# EAGLE design CM_V2-1 (EAGLE 9.4.2)
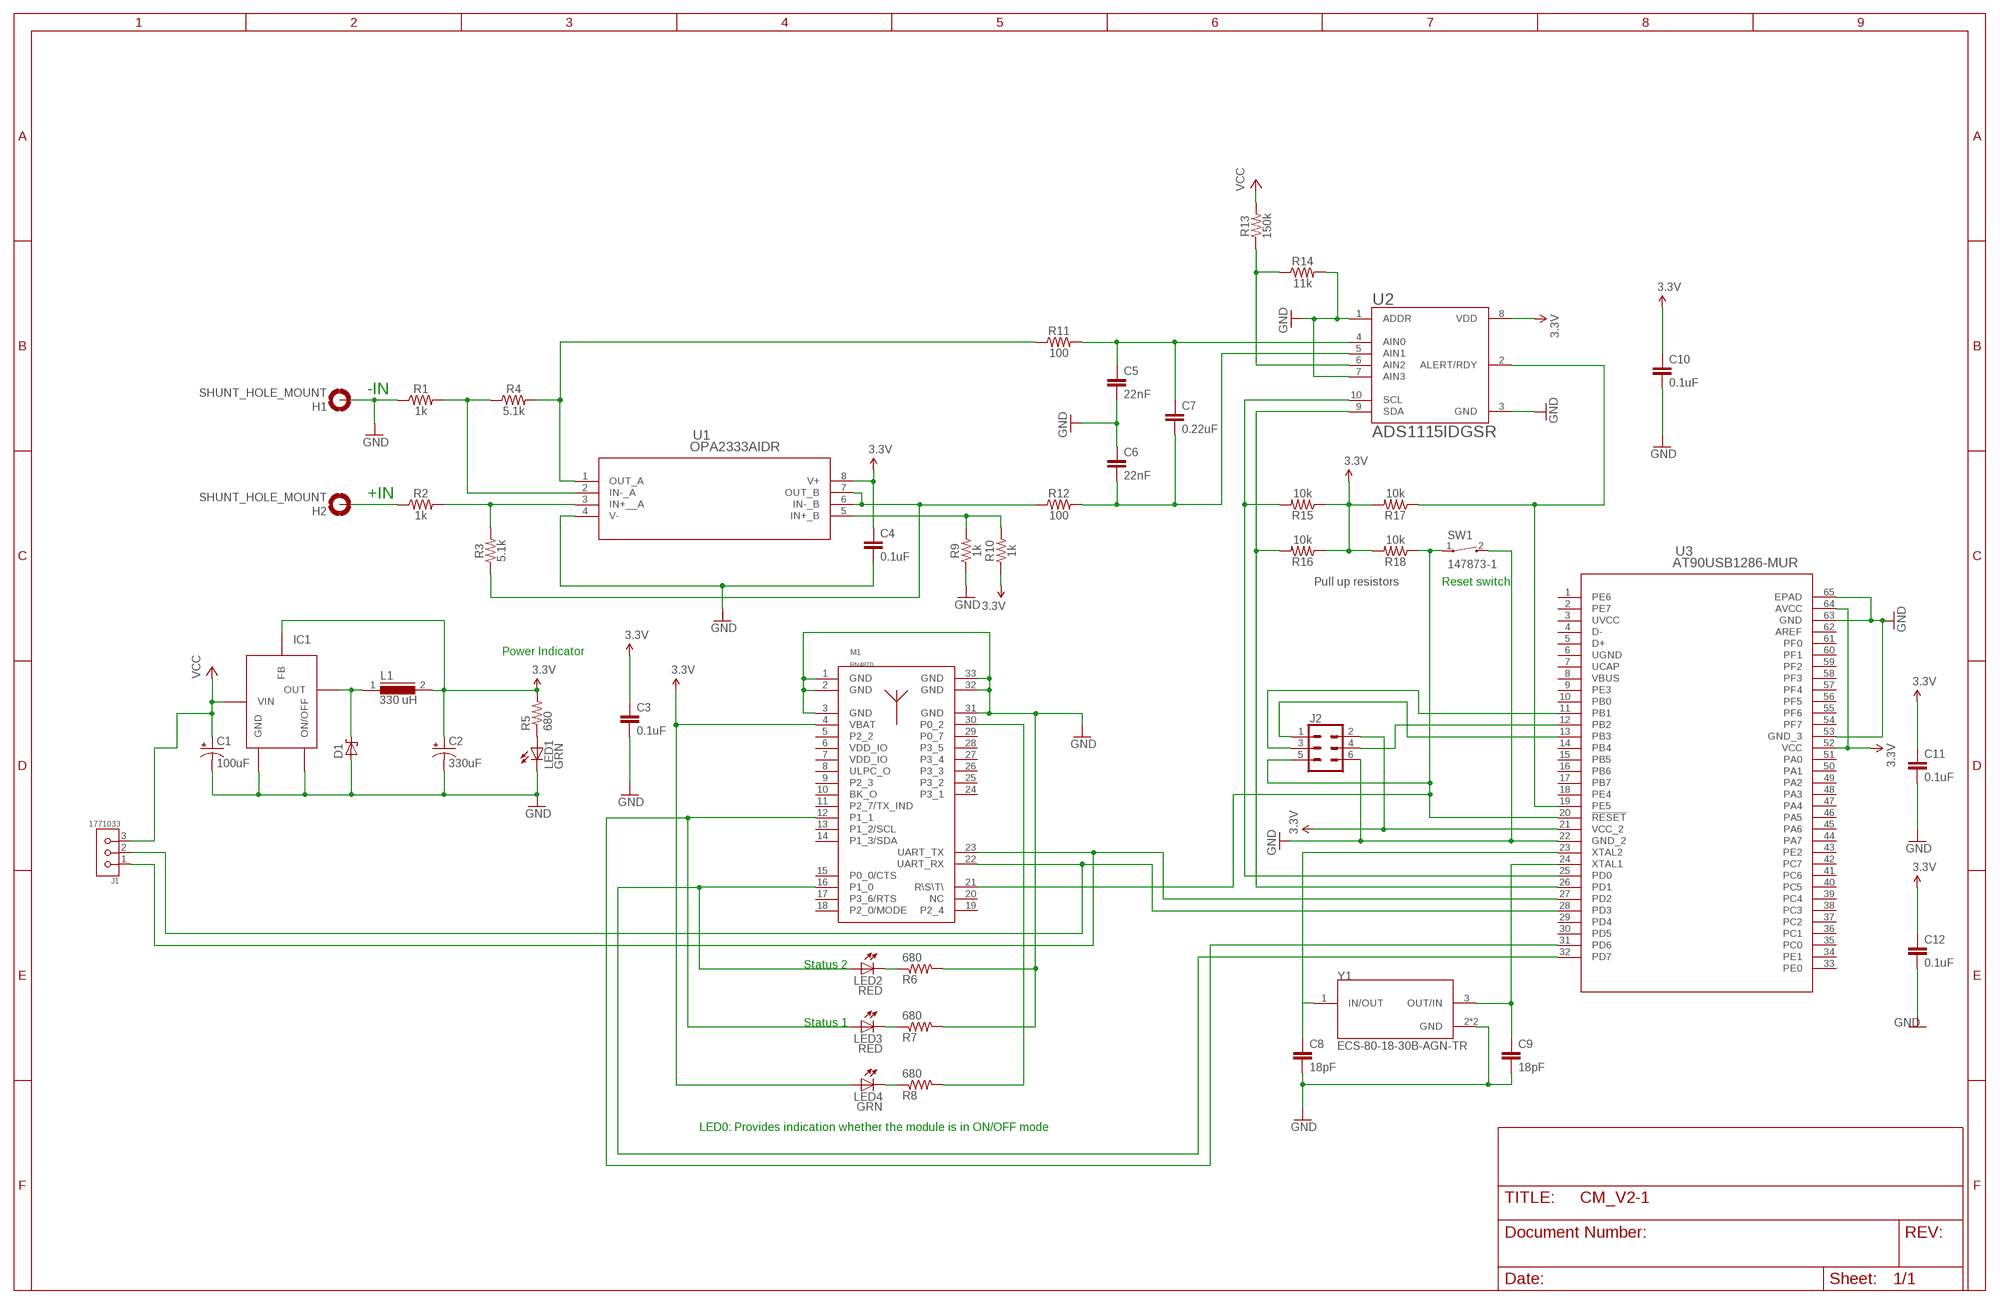
[diagram p0: schematic, sheet 1]

## Parts
C1  100uF  CAP_POLF  [F_CAP]
C2  330uF  CAP_POLF  [F_CAP]
C3  0.1uF  0.1UF-0603-25V-5%  [0603]
C4  0.1uF  0.1UF-0603-25V-(+80/-20%)  [0603]
C5  22nF  22NF/22,000PF-0603-50V-10%  [0603]
C6  22nF  22NF/22,000PF-0603-50V-10%  [0603]
C7  0.22uF  0.22UF-0603-25V-10%  [0603]
C8  18pF  18PF-0603-50V-5%  [0603]
C9  18pF  18PF-0603-50V-5%  [0603]
C10  0.1uF  0.1UF-0603-25V-5%  [0603]
C11  0.1uF  0.1UF-0603-25V-5%  [0603]
C12  0.1uF  0.1UF-0603-25V-5%  [0603]
D1  SCHOTTKY_DIODE  [SMD_DIODE]
H1  SHUNT_HOLE_MOUNT  [4,1-PAD]
H2  SHUNT_HOLE_MOUNT  [4,1-PAD]
IC1  TL2575  [TO-263-6]
J1  1771033  [PHOENIX_1771033]
J2  CONN_03X2FEMALE_SMD  [2X3_SMD]
L1  330 uH  DR125  [DR125]
LED1  GRN  LED0603  [0603_LED]
LED2  RED  LED0603  [0603_LED]
LED3  RED  LED0603  [0603_LED]
LED4  GRN  LED0603  [0603_LED]
M1  RN4870  [RN4870]
R1  1k  1KOHM-0603-1/10W-1%  [0603]
R2  1k  1KOHM-0603-1/10W-1%  [0603]
R3  5.1k  RESISTOR0603  [0603]
R4  5.1k  RESISTOR0603  [0603]
R5  680  RESISTOR0603  [0603_RESISTOR]
R6  680  RESISTOR0603  [0603_RESISTOR]
R7  680  RESISTOR0603  [0603_RESISTOR]
R8  680  RESISTOR0603  [0603_RESISTOR]
R9  1k  1KOHM-0603-1/10W-1%  [0603]
R10  1k  1KOHM-0603-1/10W-1%  [0603]
R11  100  100OHM-0603-1/4W-5%  [0603]
R12  100  100OHM-0603-1/4W-5%  [0603]
R13  150k  150KOHM-0603-1/10W-1%  [0603]
R14  11k  RESISTOR0603  [0603]
R15  10k  10KOHM-0603-1/10W-1%  [0603]
R16  10k  10KOHM-0603-1/10W-1%  [0603]
R17  10k  10KOHM-0603-1/10W-1%  [0603]
R18  10k  10KOHM-0603-1/10W-1%  [0603]
SW1  147873-1  [SW_147873-1]
U1  OPA2333AIDR  [D8]
U2  ADS1115IDGSR  [SOP50P490X110-10N]
U3  AT90USB1286-MUR  [PS]
Y1  ECS-80-18-30B-AGN-TR  [XTAL_ECS-80-18-30B-AGN-TR]

## Nets
3.3V: C2.+ C3.1 C4.1 C10.1 C11.1 C12.1 IC1.4(FB) J2.2 L1.2 LED4.A M1.4(VBAT) R5.2 R10.1 R15.1 R16.1 R17.2 R18.2 U1.8(V+) U2.8(VDD) U3.21(VCC_2) U3.52(VCC) U3.64(AVCC)
GND: C1.- C2.- C3.2 C4.2 C5.2 C6.1 C8.2 C9.2 C10.2 C11.2 C12.2 D1.A H1.B4,1(MOUNT) IC1.3(GND) IC1.5(ON/OFF) J2.6 LED1.C M1.1(GND) M1.2(GND) M1.3(GND) M1.31(GND) M1.32(GND) M1.33(GND) R1.1 R6.2 R7.2 R9.1 R14.2 SW1.2 U1.4(V-) U2.1(ADDR) U2.3(GND) U2.7(AIN3) U3.22(GND_2) U3.53(GND_3) U3.63(GND) U3.65(EPAD) Y1.2(GND) Y1.4(GND)
N$1: C5.1 C7.1 R11.2 U2.4(AIN0)
N$2: R9.2 R10.2 U1.5(IN+_B)
N$3: R15.2 U2.10(SCL) U3.25(PD0)
N$4: R16.2 U2.9(SDA) U3.26(PD1)
N$5: H2.B4,1(MOUNT) R2.1
N$6: R4.2 R11.1 U1.1(OUT_A)
N$7: C6.2 C7.2 R12.2 U2.5(AIN1)
N$8: R1.2 R4.1 U1.2(IN-_A)
N$9: J1.2 M1.22(UART_RX) U3.28(PD3)
N$10: J1.1 M1.23(UART_TX) U3.27(PD2)
N$11: D1.C IC1.2(OUT) L1.1
N$12: LED1.A R5.1
N$13: R2.2 R3.2 U1.3(IN+__A)
N$14: R3.1 R12.1 U1.6(IN-_B) U1.7(OUT_B)
N$15: LED2.C R6.1
N$16: LED3.C R7.1
N$17: LED4.C R8.1
N$18: M1.30(P0_2) R8.2
N$19: LED3.A M1.12(P1_1) U3.31(PD6)
N$20: LED2.A M1.16(P1_0) U3.32(PD7)
N$21: J2.4 U3.12(PB2)
N$22: J2.1 U3.13(PB3)
N$23: J2.3 U3.11(PB1)
N$24: J2.5 M1.21(R\S\T\) R18.1 SW1.1 U3.20(!RESET)
N$25: C8.1 U3.23(XTAL2) Y1.1(IN/OUT)
N$26: C9.1 U3.24(XTAL1) Y1.3(OUT/IN)
N$27: R17.1 U2.2(ALERT/RDY) U3.19(PE5)
N$30: R13.1 R14.1 U2.6(AIN2)
VCC: C1.+ IC1.1(VIN) J1.3 R13.2
Unconnected: M1.5(P2_2) M1.8(ULPC_O) M1.9(P2_3) M1.10(BK_O) M1.11(P2_7/TX_IND) M1.13(P1_2/SCL) M1.14(P1_3/SDA) M1.15(P0_0/CTS) M1.17(P3_6/RTS) M1.18(P2_0/MODE) M1.19(P2_4) M1.20(NC) M1.24(P3_1) M1.25(P3_2) M1.26(P3_3) M1.27(P3_4) M1.28(P3_5) M1.29(P0_7) U3.1(PE6) U3.2(PE7) U3.4(D-) U3.5(D+) U3.7(UCAP) U3.9(PE3) U3.10(PB0) U3.14(PB4) U3.15(PB5) U3.16(PB6) U3.17(PB7) U3.18(PE4) U3.29(PD4) U3.30(PD5) U3.33(PE0) U3.34(PE1) U3.35(PC0) U3.36(PC1) U3.37(PC2) U3.38(PC3) U3.39(PC4) U3.40(PC5) U3.41(PC6) U3.42(PC7) U3.43(PE2) U3.44(PA7) U3.45(PA6) U3.46(PA5) U3.47(PA4) U3.48(PA3) U3.49(PA2) U3.50(PA1) U3.51(PA0) U3.54(PF7) U3.55(PF6) U3.56(PF5) U3.57(PF4) U3.58(PF3) U3.59(PF2) U3.60(PF1) U3.61(PF0)

## Notes on the sheet
- -IN
- +IN
- Pull up resistors | Reset switch
- Power Indicator
- Status 2
- Status 1
- LED0: Provides indication whether the module is in ON/OFF mode

## Power pins joined to a net without a drawn wire
AREF: U3.62(AREF)
UGND: U3.6(UGND)
UVCC: U3.3(UVCC)
VBUS: U3.8(VBUS)
VDD_IO: M1.6(VDD_IO) M1.7(VDD_IO)

## Library data of the parts
C1 = jkf:CAP_POL; DIGIKEY#: PCE3917CT-ND
C2 = jkf:CAP_POL; DIGIKEY#: PCE3401CT-ND
C3 C10-C12 = SparkFun-Capacitors:0.1UF: 0.1µF ceramic capacitors A capacitor is a passive two-terminal electrical component used to store electrical energy temporarily in an electric field.; PROD_ID: CAP-08604
C4 = SparkFun-Capacitors:0.1UF: 0.1µF ceramic capacitors A capacitor is a passive two-terminal electrical component used to store electrical energy temporarily in an electric field.; PROD_ID: CAP-00810
C5 C6 = SparkFun-Capacitors:22NF/22,000PF: 0.022uF/22nF/22,000pF ceramic capacitors A capacitor is a passive two-terminal electrical component used to store electrical energy temporarily in an electric field.; PROD_ID: CAP-07885
C7 = SparkFun-Capacitors:0.22UF: 0.22µF ceramic capacitors A capacitor is a passive two-terminal electrical component used to store electrical energy temporarily in an electric field.; PROD_ID: CAP-07822
C8 C9 = SparkFun-Capacitors:18PF: 18pF ceramic capacitors A capacitor is a passive two-terminal electrical component used to store electrical energy temporarily in an electric field.; PROD_ID: CAP-08267
D1 = jkf:SCHOTTKY_DIODE; DIGIKEY#: 1N5819HW-FDICT-ND; MANF: Diodes Inc; MANF#: 1N5819HW-7-F
H1 H2 = custom_hole_shunt:SHUNT_HOLE_MOUNT
IC1 = jkf:TL2575; DIGIKEY#: 296-21828-1-ND; MANF: Texas Instruments; MANF#: TL2575-33IKTTR
J1 = 1771033:1771033: Fixed Miniature Connectors, Spring Cage, Horizontal, SMD, 3 Pos; DESCRIPTION: Fixed Miniature Connectors, Spring Cage, Horizontal, SMD, 3 Pos; DIGI-KEY_PART_NUMBER: 277-2066-1-ND; DIGI-KEY_PURCHASE_URL: https://www.digikey.com/product-detail/en/phoenix-contact/1771033/277-2066-1-ND/2192476?utm_source=snapeda&utm_medium=aggregator&utm_campaign=symbol; MF: Phoenix Contact; MP: 1771033; PACKAGE: None
J2 = SparkFun-Connectors:CONN_03X2: Multi connection point. Often used as Generic Header-pin footprint for 0.1 inch spaced/style header connections You can populate with any combo of single row headers, but if you'd like an exact match, check these: Header - 2x3 (Male, 0.1") <https://www.sparkfun.com/products/12807> (PRT-12807) Header - 2x3 (Female, 0.1") <https://www.sparkfun.com/products/13010> (PRT-13010) 2x3 Pin Shrouded Header <https://www.sparkfun.com/products/10877> (PRT-10877) On any of the 0.1 inch spaced packages, you can populate with these: Break Away Headers - Straight <https://www.sparkfun.com/products/116> (PRT-00116) Break Away Male Headers - Right Angle <https://www.sparkfun.com/products/553> (PRT-00553) Female Headers <https://www.sparkfun.com/products/115> (PRT-00115) Break Away Headers - Machine Pin <https://www.sparkfun.com/products/117> (PRT-00117) Break Away Female Headers - Swiss Machine Pin <https://www.sparkfun.com/products/743> (PRT-00743) Special note: the shrouded connector mates well with our 3x2 ribbon cables: Ribbon Crimp Connector - 6-pin (2x3, Female) <https://www.sparkfun.com/products/10651> (PRT-10651) Ribbon Cable - 6 wire (15ft) <https://www.sparkfun.com/products/10646> (PRT-10646); PROD_ID: CONN-11290
L1 = jkf:DR125; DIGIKEY#: SRR1208-102KLCT-ND
LED1-LED4 = jkf:LED; DIGIKEY#: 516-2493-1-ND; MANF: Avago Technologies; MANF#: HSMG-C191
M1 = RN4870:RN4870
R1 R2 R9 R10 = SparkFun-Resistors:1KOHM: 1kΩ resistor A resistor is a passive two-terminal electrical component that implements electrical resistance as a circuit element. Resistors act to reduce current flow, and, at the same time, act to lower voltage levels within circuits. - Wikipedia; PROD_ID: RES-07856
R3 R4 R14 = SparkFun-Resistors:RESISTOR: Generic Resistor Package
R5-R8 = jkf:RESISTOR; DIGIKEY#: P680GCT-ND
R11 R12 = SparkFun-Resistors:100OHM: 100Ω resistor A resistor is a passive two-terminal electrical component that implements electrical resistance as a circuit element. Resistors act to reduce current flow, and, at the same time, act to lower voltage levels within circuits. - Wikipedia; PROD_ID: RES-12438
R13 = SparkFun-Resistors:150KOHM: 150kΩ resistor A resistor is a passive two-terminal electrical component that implements electrical resistance as a circuit element. Resistors act to reduce current flow, and, at the same time, act to lower voltage levels within circuits. - Wikipedia; PROD_ID: RES-09117
R15-R18 = SparkFun-Resistors:10KOHM: 10kΩ resistor A resistor is a passive two-terminal electrical component that implements electrical resistance as a circuit element. Resistors act to reduce current flow, and, at the same time, act to lower voltage levels within circuits. - Wikipedia; PROD_ID: RES-00824
SW1 = 147873-1:147873-1: Switch Tactile OFF (ON) SPST Rectangular Button J-Bend 0.05A 24VDC 1.77N SMD T/R; AVAILABILITY: Unavailable; COMMENT: 147873-1; DESCRIPTION: Switch Tactile OFF _ON_ SPST Rectangular Button J-Bend 0.05A 24VDC 1.77N SMD T/R; MF: TE Connectivity; MP: 147873-1; PACKAGE: None; PRICE: None; TE_PURCHASE_URL: https://www.te.com/usa-en/product-147873-1.html?te_bu=Cor&te_type=disp&te_campaign=seda_glo_cor-seda-global-disp-prtnr-fy19-seda-model-bom-cta_sma-317_1&elqCampaignId=32493
U1 = OPA2333AIDR:OPA2333AIDR; MANUFACTURER_PART_NUMBER: OPA2333AIDR; VENDOR: Texas Instruments
U2 = ADS1115IDGSR:ADS1115IDGSR: 16-Bit ADC with Integrated MUX, PGA, Comparator, Oscillator, and Reference 10-VSSOP -40 to 125; DESCRIPTION: 16-Bit ADC with Integrated MUX, PGA, Comparator, Oscillator, and Reference 10-VSSOP -40 to 125; DIGI-KEY_PART_NUMBER: 296-38849-1-ND; DIGI-KEY_PURCHASE_URL: https://www.digikey.com/product-detail/en/texas-instruments/ADS1115IDGSR/296-38849-1-ND/5142969?utm_source=snapeda&utm_medium=aggregator&utm_campaign=symbol; MF: Texas Instruments; MP: ADS1115IDGSR; PACKAGE: MSOP-10 Texas Instruments
U3 = AT90USB1286:AT90USB1286-MUR; MANUFACTURER_PART_NUMBER: AT90USB1286MUR; VENDOR: Atmel
Y1 = ECS-80-18-30B-AGN-TR:ECS-80-18-30B-AGN-TR: The ECX-53B is a miniature SMD Crystal with a 3.2 x 5 mm footprint. This package is ideal for todays compact wireless applications where board space is critical.; DESCRIPTION: Crystal 8MHz ±25ppm _Tol_ ±30ppm _Stability_ 18pF FUND 100Ohm 4-Pin Mini-SMD T/R; DIGI-KEY_PART_NUMBER: XC2709CT-ND; DIGI-KEY_PURCHASE_URL: https://www.digikey.com/product-detail/en/ecs-inc/ECS-80-18-30B-AGN-TR/XC2709CT-ND/8023644?utm_source=snapeda&utm_medium=aggregator&utm_campaign=symbol; MF: ECS Inc.; MP: ECS-80-18-30B-AGN-TR; PACKAGE: SMD-4 ECS International

## Board
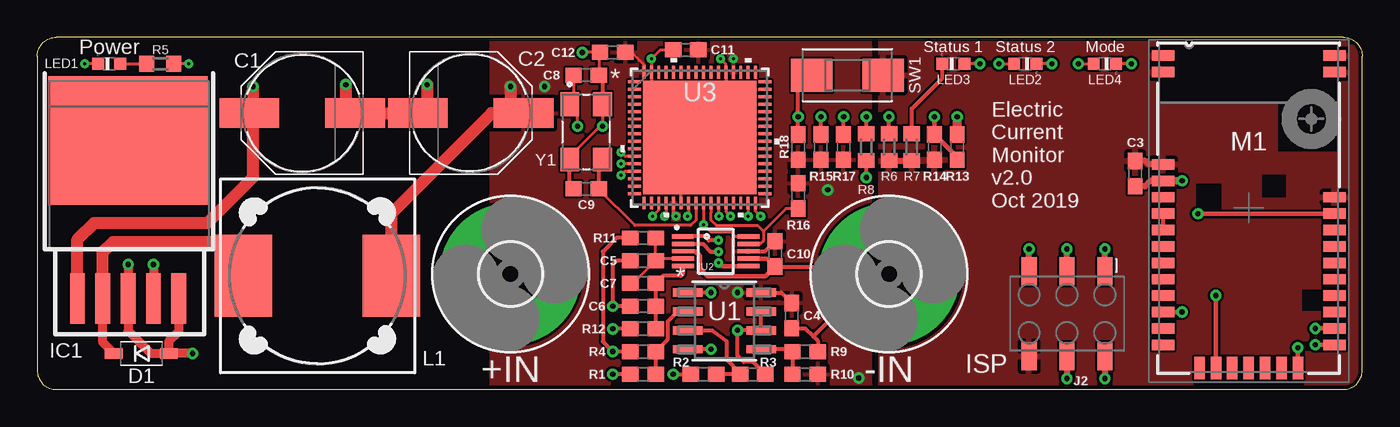
[diagram p1: board, top side]
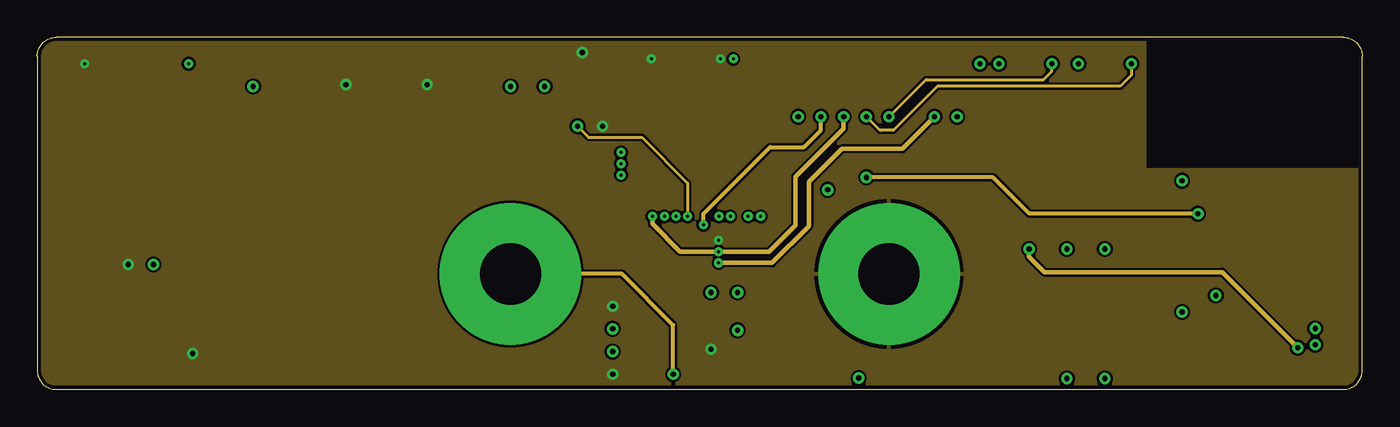
[diagram p2: board, inner layer Route2]
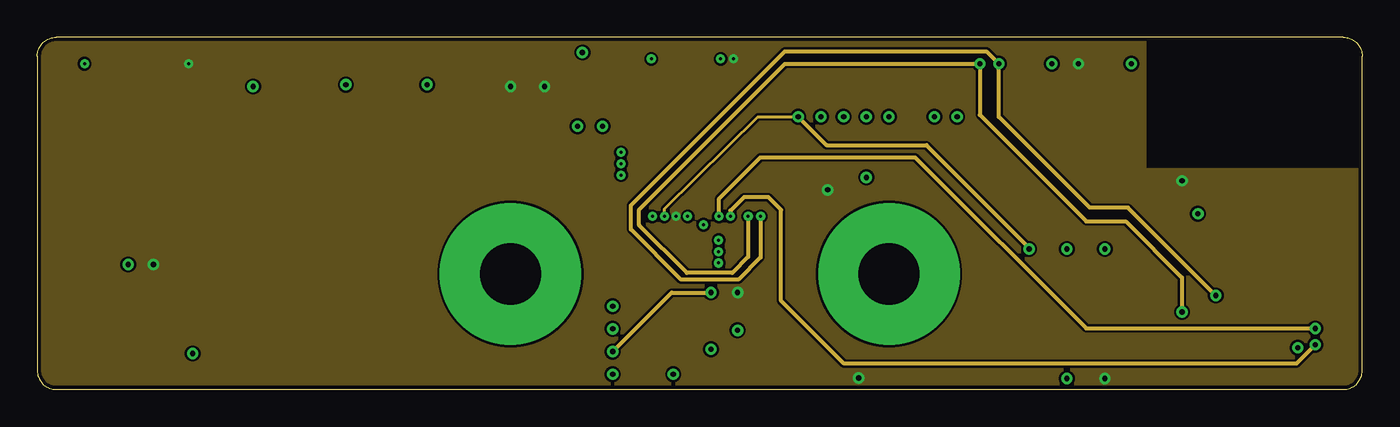
[diagram p3: board, inner layer Route15]
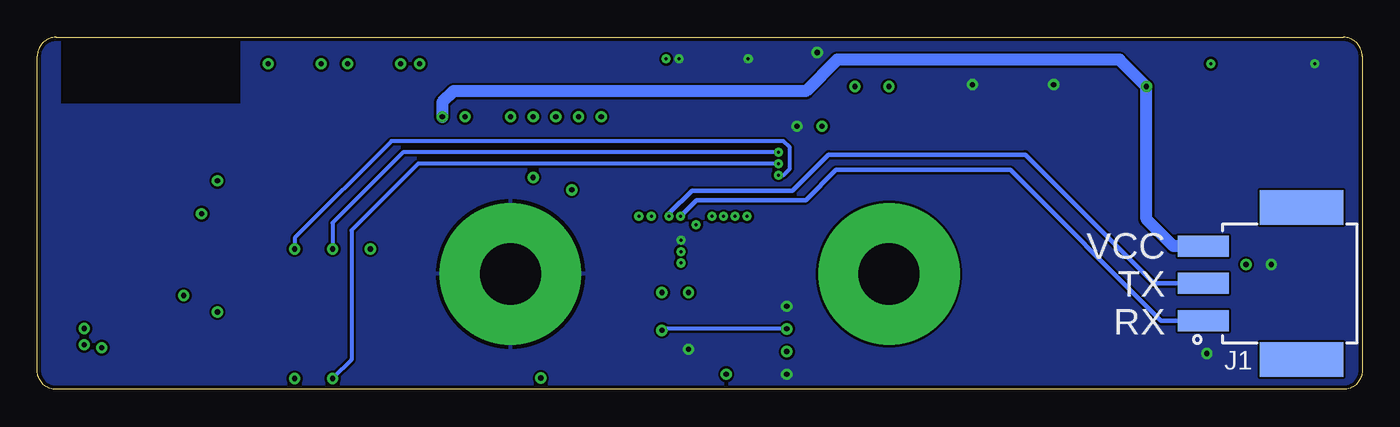
[diagram p4: board, bottom side, seen from below]

Size 88.9 x 23.62 mm. Coordinates in mm from the lower left corner, seen from the top.
Outline: 1.27,0 87.63,0 arc90 88.9,1.27 88.9,22.35 arc90 87.63,23.62 1.27,23.62 arc90 0,22.35 0,1.27 arc90 1.27,0
Copper layers (1+2*15+16): Top 0.0178mm / dielectric 12mil / Route2 0.0356mm / dielectric 28mil / Route15 0.0356mm / dielectric 12mil / Bottom 0.0178mm
Design rules "SSC-EAGLE-4Lyr_v1.0.0.3 *": minimum track width 6mil, minimum drill 8mil, track to track 6mil, track to pad 5mil, pad to pad 5mil, via to via 6mil, smd to smd 5mil, copper to edge 10mil, drill to drill 16mil, minimum pad ring 8mil, minimum via ring 8mil, stop-mask expansion 3mil, vias tented up to drill 14mil, thermal gap 10mil

### Footprints (pad centres in the part's own frame; a part is rotated, then mirrored left to right if it is on the bottom)
F_CAP = smd 4 x 2: + 3.55,0; - -3.55,0
0603 = smd 1.1 x 1: 1 -0.85,0; 2 0.85,0
SMD_DIODE = smd 1.2 x 0.7: A -1.85,0; C 1.85,0
4,1-PAD = drill 4.1 pad 9.5: B4,1 0,0
TO-263-6 = smd 1 x 3.4: 1 -3.4,-6.6; 2 -1.7,-6.6; 3 0,-6.6; 4 1.7,-6.6; 5 3.4,-6.6 | smd 10.7 x 8.6: P$1 0,4
PHOENIX_1771033 = smd 1.4 x 3.4: 1 -2.5,6.6; 2 0,6.6; 3 2.5,6.6 | smd 2.3 x 5.6: P$1 -5.1,0; P$2 5.1,0
2X3_SMD = smd 1.02 x 1.9: 1 -2.54,-2.85; 2 -2.54,2.85; 3 0,-2.85; 4 0,2.85; 5 2.54,-2.85; 6 2.54,2.85
DR125 = smd 3.85 x 5.5: 1 -4.975,0; 2 4.975,0
0603_LED = smd 0.8 x 0.8: A -0.75,0; C 0.75,0
RN4870 = smd 1.5 x 0.7: 1 -5.742,10.2; 2 -5.742,9.1; 3 -5.75,2.9; 4 -5.75,1.8; 5 -5.75,0.7; 6 -5.75,-0.4; 7 -5.75,-1.5; 8 -5.75,-2.6; 9 -5.75,-3.7; 10 -5.75,-4.8; 11 -5.75,-5.9; 12 -5.75,-7; 13 -5.75,-8.1; 14 -5.75,-9.2; 22 5.75,-9.2; 23 5.75,-8.1; 24 5.75,-7; 25 5.75,-5.9; 26 5.75,-4.8; 27 5.75,-3.7; 28 5.75,-2.6; 29 5.75,-1.5; 30 5.75,-0.4; 31 5.75,0.7; 32 5.75,9.1; 33 5.75,10.2 | smd 0.7 x 1.5: 15 -3.3,-10.75; 16 -2.2,-10.75; 17 -1.1,-10.75; 18 0,-10.75; 19 1.1,-10.75; 20 2.2,-10.75; 21 3.3,-10.75
0603_RESISTOR = smd 1 x 1.1: 1 -0.9,0; 2 0.9,0
SW_147873-1 = smd 2.8 x 2.2: 1 -2.4,0; 2 2.4,0
D8 = smd 1.981 x 0.559: 1 -2.464,1.905; 2 -2.464,0.635; 3 -2.464,-0.635; 4 -2.464,-1.905; 5 2.464,-1.905; 6 2.464,-0.635; 7 2.464,0.635; 8 2.464,1.905
SOP50P490X110-10N = smd 1.45 x 0.3: 1 -2.2,1 | smd 1.47 x 0.3: 2 -2.2,0.5; 3 -2.2,0; 4 -2.2,-0.5; 5 -2.2,-1; 6 2.2,-1; 7 2.2,-0.5; 8 2.2,0; 9 2.2,0.5; 10 2.2,1
PS = smd 0.855 x 0.198: 1 -4.377,3.75; 2 -4.377,3.25; 3 -4.377,2.75; 4 -4.377,2.25; 5 -4.377,1.75; 6 -4.377,1.25; 7 -4.377,0.75; 8 -4.377,0.25; 9 -4.377,-0.25; 10 -4.377,-0.75; 11 -4.377,-1.25; 12 -4.377,-1.75; 13 -4.377,-2.25; 14 -4.377,-2.75; 15 -4.377,-3.25; 16 -4.377,-3.75; 33 4.377,-3.75; 34 4.377,-3.25; 35 4.377,-2.75; 36 4.377,-2.25; 37 4.377,-1.75; 38 4.377,-1.25; 39 4.377,-0.75; 40 4.377,-0.25; 41 4.377,0.25; 42 4.377,0.75; 43 4.377,1.25; 44 4.377,1.75; 45 4.377,2.25; 46 4.377,2.75; 47 4.377,3.25; 48 4.377,3.75 | smd 0.198 x 0.855: 17 -3.75,-4.377; 18 -3.25,-4.377; 19 -2.75,-4.377; 20 -2.25,-4.377; 21 -1.75,-4.377; 22 -1.25,-4.377; 23 -0.75,-4.377; 24 -0.25,-4.377; 25 0.25,-4.377; 26 0.75,-4.377; 27 1.25,-4.377; 28 1.75,-4.377; 29 2.25,-4.377; 30 2.75,-4.377; 31 3.25,-4.377; 32 3.75,-4.377; 49 3.75,4.377; 50 3.25,4.377; 51 2.75,4.377; 52 2.25,4.377; 53 1.75,4.377; 54 1.25,4.377; 55 0.75,4.377; 56 0.25,4.377; 57 -0.25,4.377; 58 -0.75,4.377; 59 -1.25,4.377; 60 -1.75,4.377; 61 -2.25,4.377; 62 -2.75,4.377; 63 -3.25,4.377; 64 -3.75,4.377 | smd 7.6 x 7.6: 65 0,0
XTAL_ECS-80-18-30B-AGN-TR = smd 1.6 x 1.25: 1 -1.85,-1.1; 2 1.85,-1.1; 3 1.85,1.1; 4 -1.85,1.1

### Placement (x,y rotation side)
C1  17.78,18.54 180 top
C2  29.08,18.54 0 top
C3  73.66,14.48 90 top
C4  50.62,4.95 270 top
C5  40.64,8.64 180 top
C6  40.64,5.59 0 top
C7  40.64,7.11 0 top
C8  36.83,21.08 0 top
C9  36.83,13.46 180 top
C10  49.5,9.09 270 top
C11  43.51,22.78 180 top
C12  38.61,22.61 180 top
D1  6.99,2.41 180 top
H1  57.15,7.75 0 top
H2  31.75,7.75 0 top
IC1  6.1,12.7 0 top
J1  4.06,7.11 90 bottom
J2  69.09,5.08 180 top
L1  18.8,7.62 0 top
LED1  4.83,21.84 180 top
LED2  66.29,21.84 0 top
LED3  61.47,21.84 180 top
LED4  71.63,21.84 0 top
M1  81.28,12.19 0 top
R1  40.64,1.02 0 top
R2  44.7,1.02 0 top
R3  48.01,1.02 180 top
R4  40.64,2.54 180 top
R5  8.26,21.84 0 top
R6  57.15,16.26 270 top
R7  58.67,16.26 270 top
R8  55.63,16.26 270 top
R9  51.52,2.54 180 top
R10  51.52,1.02 180 top
R11  40.64,10.16 0 top
R12  40.64,4.06 0 top
R13  61.72,16.26 90 top
R14  60.2,16.26 270 top
R15  52.58,16.26 90 top
R16  51.05,12.98 270 top
R17  54.1,16.26 270 top
R18  51.05,16.26 270 top
SW1  54.36,21.08 0 top
U1  46.1,4.6 0 top
U2  45.52,9.27 0 top
U3  44.45,16.89 0 top
Y1  36.83,17.27 270 top

### Tracks (layer width: path | path; a pad name or v marks a point on that pad's centre or on a via)
3.3V  (via drill 0.2, 0.35)
  Top 0.203: v10.16,21.84 R5.2 | v69.85,21.84 LED4.A | C12.1 39.88,22.61 40.7,21.78 U3.64 | v42.85,11.61 42.7,11.76 U3.21
  Top 0.254: C10.1 48.83,9.27 U2.8 | U1.8 49.92,6.5 C4.1
  Top 0.406: J2.2 v71.63,0.74 | M1.4 74.7,13.99 74.33,13.63 C3.1
  Top 0.508: M1.4 v76.81,13.99
  Top 0.61: v7.8,8.38 IC1.4
  Top 0.813: L1.2 23.77,11.83 30.48,18.54 31.75,18.54 | 31.75,18.54 C2.+ | v31.75,20.32 31.75,18.54
  other vias: 46.99,6.5 46.7,22.17 34.04,20.32 55.12,0.76 53.04,13.39
  pour Top: 30.48,0 30.48,23.62 55.88,23.62 55.88,0
  pour Route15: 0,0 0,23.62 74.3,23.62 74.3,14.73 88.9,14.73 88.9,0
GND  (via drill 0.2, 0.35)
  Top 0.203: Y1.4 v37.93,17.65 37.77,17.65 35.73,15.61 Y1.2 | LED1.C v3.17,21.84 | C11.2 41.81,22.78 v41.2,22.17 U3.63 41.2,20.14 U3.65 | U3.22 43.2,15.64 U3.65 | U3.65 46.2,18.64 U3.53 46.2,21.82 v45.85,22.17 | v36.58,22.61 C12.2 37.68,22.53 C8.2
  Top 0.254: C6.1 v38.61,5.59 38.61,8.38 38.86,8.64 C5.2 | R1.1 v38.61,1.02 | v45.21,2.69 U1.4 | C4.2 51.52,4.1 52.07,3.56 | R9.1 52.37,3.25 52.07,3.56 | 52.07,3.56 56.26,7.75 H1.B4,1 56.65,8.24 C10.2 | C9.2 35.73,13.71 Y1.2 | C8.2 37.93,20.83 Y1.4 | v45.72,10.01 45.06,10.01 44.8,10.27 U2.1
  Top 0.305: U2.7 48.98,8.77 C10.2 48.86,7.59 44.98,7.59 44.45,8.13 44.45,8.97 44.15,9.27 U2.3
  Top 0.406: R6.2 R7.2 | M1.3 74.57,15.09 74.33,15.33 C3.2
  Top 0.61: v6.1,8.38 IC1.3 6.1,3.94 7.62,2.41 D1.A | v10.42,2.41 D1.A | IC1.5 9.5,3.88 8.84,3.22 D1.A
  Top 0.813: v26.16,20.45 26.16,19.17 C2.- C1.- 20.7,19.17 v20.7,20.45
  pour Route2: 0,0 0,23.62 74.3,23.62 74.3,14.73 88.9,14.73 88.9,0
  pour Bottom: 0,0 0,23.62 88.9,23.62 88.9,0
  pour Top: 56.64,23.62 88.9,23.62 88.9,0 56.64,0
N$1
  Top 0.2: U2.4 41.62,8.77 C5.1 | C5.1 R11.2 | C5.1 39.97,7.11 C7.1
N$2
  Top 0.254: R10.2 R9.2 50.52,2.69 U1.5
N$3  (via drill 0.2, 0.35)
  Top 0.203: U3.25 v44.7,11.05 45.18,10.57 46.53,10.57 46.83,10.27 U2.10
  Top 0.254: R15.2 v52.58,18.29
  Route2 0.254: v44.7,11.05 44.7,11.78 49.17,16.26 51.44,16.26 52.58,17.4 v52.58,18.29
N$4
  Top 0.203: U3.26 45.2,11.85 45.19,11.84 45.19,11.38 45.56,11 48.34,11 48.72,10.62 | 48.72,10.62 48.72,9.98 48.51,9.77 U2.9 | R16.2 50.23,12.13 48.72,10.62
N$5  (via drill 0.35)
  Top 0.254: v42.67,1.02 R2.1
  Route2 0.254: v42.67,1.02 42.67,4.32 39.24,7.75 H2.B4,1
N$6  (via drill 0.35)
  Top 0.254: R11.1 38.86,10.16 37.95,9.25 37.95,3.2 v38.61,2.54 R4.2 | v45.21,6.5 U1.1
  Route15 0.254: v38.61,2.54 42.57,6.5 v45.21,6.5
N$7
  Top 0.254: R12.2 C6.2 C7.2 42,7.62 43.18,7.62 43.32,7.76 U2.5
N$8
  Top 0.254: R1.2 R4.1 42.32,3.37 42.32,4.57 42.98,5.23 U1.2
N$9  (via drill 0.2, 0.35)
  Top 0.203: U3.28 46.2,11.94 46.3,11.84 46.3,11.81 v46.51,11.61
  Top 0.305: v85.75,2.99 M1.22
  Route15 0.254: v85.75,2.99 84.49,1.73 54.13,1.73 49.91,5.94 49.91,12.04 49.05,12.9 47.42,12.9 46.51,11.99 v46.51,11.61
  Bottom 0.305: v46.51,11.61 46.51,11.81 44.98,13.34 38.23,13.34 35.81,15.75 22.61,15.75 13.97,7.11 J1.2
N$10  (via drill 0.2, 0.35)
  Top 0.203: U3.27 45.7,11.65 v45.74,11.61
  Top 0.305: v85.75,4.09 M1.23
  Route15 0.254: v45.74,11.61 45.74,12.8 48.51,15.57 58.9,15.57 70.38,4.09 v85.75,4.09
  Bottom 0.305: v45.74,11.61 44.65,12.7 37.34,12.7 35.31,14.73 23.62,14.73 13.5,4.61 J1.1
N$11
  Top 0.61: D1.C 4.4,3.15 IC1.2
  Top 0.813: L1.1 13.82,8.79 12.7,9.91 5.08,9.91 4.4,9.22 IC1.2
N$12
  Top 0.203: LED1.A R5.1
N$13
  Top 0.254: R2.2 R3.2 47.16,1.1 46.23,2.03 46.23,3.26 45.28,3.96 U1.3
N$14  (via drill 0.35)
  Top 0.254: R12.1 v38.61,4.06 | R3.1 48.02,1.85 47.41,1.85 46.99,2.28 v46.99,3.96 U1.6 U1.7
  Bottom 0.254: v38.61,4.06 46.89,4.06 v46.99,3.96
N$15  (via drill 0.35)
  Top 0.203: v68.07,21.84 LED2.C
  Top 0.254: R6.1 v57.15,18.29
  Route2 0.203: v57.15,18.29 59.64,20.78 67.51,20.78 68.07,21.34 v68.07,21.84
N$16
  Top 0.254: R7.1 58.67,18.83 60.72,20.88 LED3.C
N$17  (via drill 0.35)
  Top 0.203: v73.41,21.84 LED4.C
  Top 0.254: R8.1 v55.63,18.29
  Route2 0.203: v73.41,21.84 73.41,21.08 72.67,20.35 60.4,20.35 57.43,17.37 56.54,17.37 v55.63,18.29
N$18  (via drill 0.35)
  Top 0.254: v55.63,14.22 R8.2
  Top 0.305: v77.88,11.79 M1.30
  Route2 0.254: v77.88,11.79 66.57,11.79 64.14,14.22 v55.63,14.22
N$19  (via drill 0.2, 0.35)
  Top 0.203: v63.25,21.84 LED3.A | U3.31 v47.7,11.61
  Top 0.305: M1.12 v76.81,5.19
  Route15 0.254: v76.81,5.19 76.81,7.49 73.03,11.28 70.38,11.28 63.25,18.41 v63.25,21.84 50.16,21.84 40.39,12.07 40.39,11.02 43.59,7.82 46.63,7.82 47.7,8.89 v47.7,11.61
N$20  (via drill 0.2, 0.35)
  Top 0.203: v64.52,21.84 LED2.A | v48.54,11.61 48.2,11.95 U3.32
  Top 0.305: v79.08,6.3 M1.16
  Route15 0.254: v79.08,6.3 73.19,12.19 70.61,12.19 64.52,18.29 v64.52,21.84 63.68,22.68 50.16,22.68 39.83,12.34 39.83,10.74 43.2,7.37 47.04,7.37 48.54,8.86 v48.54,11.61
N$21  (via drill 0.2, 0.35)
  Top 0.203: U3.12 v39.17,15.14
  Top 0.406: J2.4 v69.09,0.74
  Bottom 0.254: v39.17,15.14 63.34,15.14 67.82,10.67 67.82,2.01 v69.09,0.74
N$22  (via drill 0.2, 0.35)
  Top 0.203: v39.17,14.38 39.37,14.58 39.4,14.58 39.45,14.64 U3.13
  Top 0.406: J2.1 v71.63,9.42
  Bottom 0.254: v39.17,14.38 38.83,14.38 38.41,14.81 38.41,16.23 38.84,16.66 65.13,16.66 71.63,10.16 v71.63,9.42
N$23  (via drill 0.2, 0.35)
  Top 0.203: U3.11 39.45,15.64 39.4,15.7 39.37,15.7 v39.17,15.9
  Top 0.406: J2.3 v69.09,9.42
  Bottom 0.254: v39.17,15.9 64.36,15.9 69.09,11.18 v69.09,9.42
N$24  (via drill 0.2, 0.35)
  Top 0.203: U3.20 42.2,11.73 v42.07,11.61
  Top 0.254: R18.1 v51.05,18.29 51.05,20.18 SW1.1
  Top 0.305: M1.21 v84.58,2.79
  Top 0.406: J2.5 v66.55,9.42
  Route2 0.305: v66.55,9.42 66.55,8.91 67.59,7.87 79.5,7.87 v84.58,2.79
  Route15 0.203: v42.07,11.61 42.07,12.11 48.37,18.29 v51.05,18.29
  Route15 0.254: v51.05,18.29 52.96,16.38 59.66,16.38 66.55,9.5 v66.55,9.42
N$25  (via drill 0.2, 0.35)
  Top 0.203: v36.25,17.65 36.25,18.61 Y1.1 35.98,19.37 C8.1 | U3.23 43.7,11.67 v43.64,11.61
  Route2 0.203: v36.25,17.65 36.98,16.92 40.56,16.92 43.64,13.84 v43.64,11.61
N$26
  Top 0.203: U3.24 44.2,11.36 43.84,11 40.11,11 37.66,13.44 C9.1
  Top 0.254: C9.1 37.68,15.17 Y1.3
N$27  (via drill 0.2, 0.35)
  Top 0.203: U3.19 41.7,12.03 v41.27,11.61
  Top 0.254: U2.2 44.65,9.77 45.18,9.25 v45.72,9.25 | R17.1 v54.1,18.29
  Route2 0.305: v54.1,18.29 54.1,17.5 50.88,14.27 50.88,11.02 49.1,9.25 v45.72,9.25 43.13,9.25 41.27,11.1 v41.27,11.61
N$30  (via drill 0.2, 0.35)
  Top 0.305: v60.2,18.29 R14.1 61.72,15.58 R13.1 | U2.6 45.93,8.27 v45.72,8.48
  Route2 0.305: v60.2,18.29 58.04,16.13 53.98,16.13 51.77,13.92 51.77,10.95 49.3,8.48 v45.72,8.48
VCC  (via drill 0.35)
  Top 0.61: R13.2 v61.72,18.29
  Top 0.762: v14.48,20.32 14.48,18.54
  Top 0.813: IC1.1 2.7,10.06 3.81,11.18 11.43,11.18 14.48,14.22 14.48,18.54 C1.+
  Bottom 0.813: J1.3 12.66,9.61 14.48,11.43 v14.48,20.32 16.28,22.12 35.23,22.12 37.34,20.02 60.96,20.02 61.72,19.25 v61.72,18.29
VDD_IO
  Top 0.254: M1.6 M1.7

### Text on the board
tNames: Power | Status 1 | Status 2 | Mode | Electric / Current / Monitor / v2.0 / Oct 2019 | +IN | -IN | ISP
bNames: VCC | TX | RX